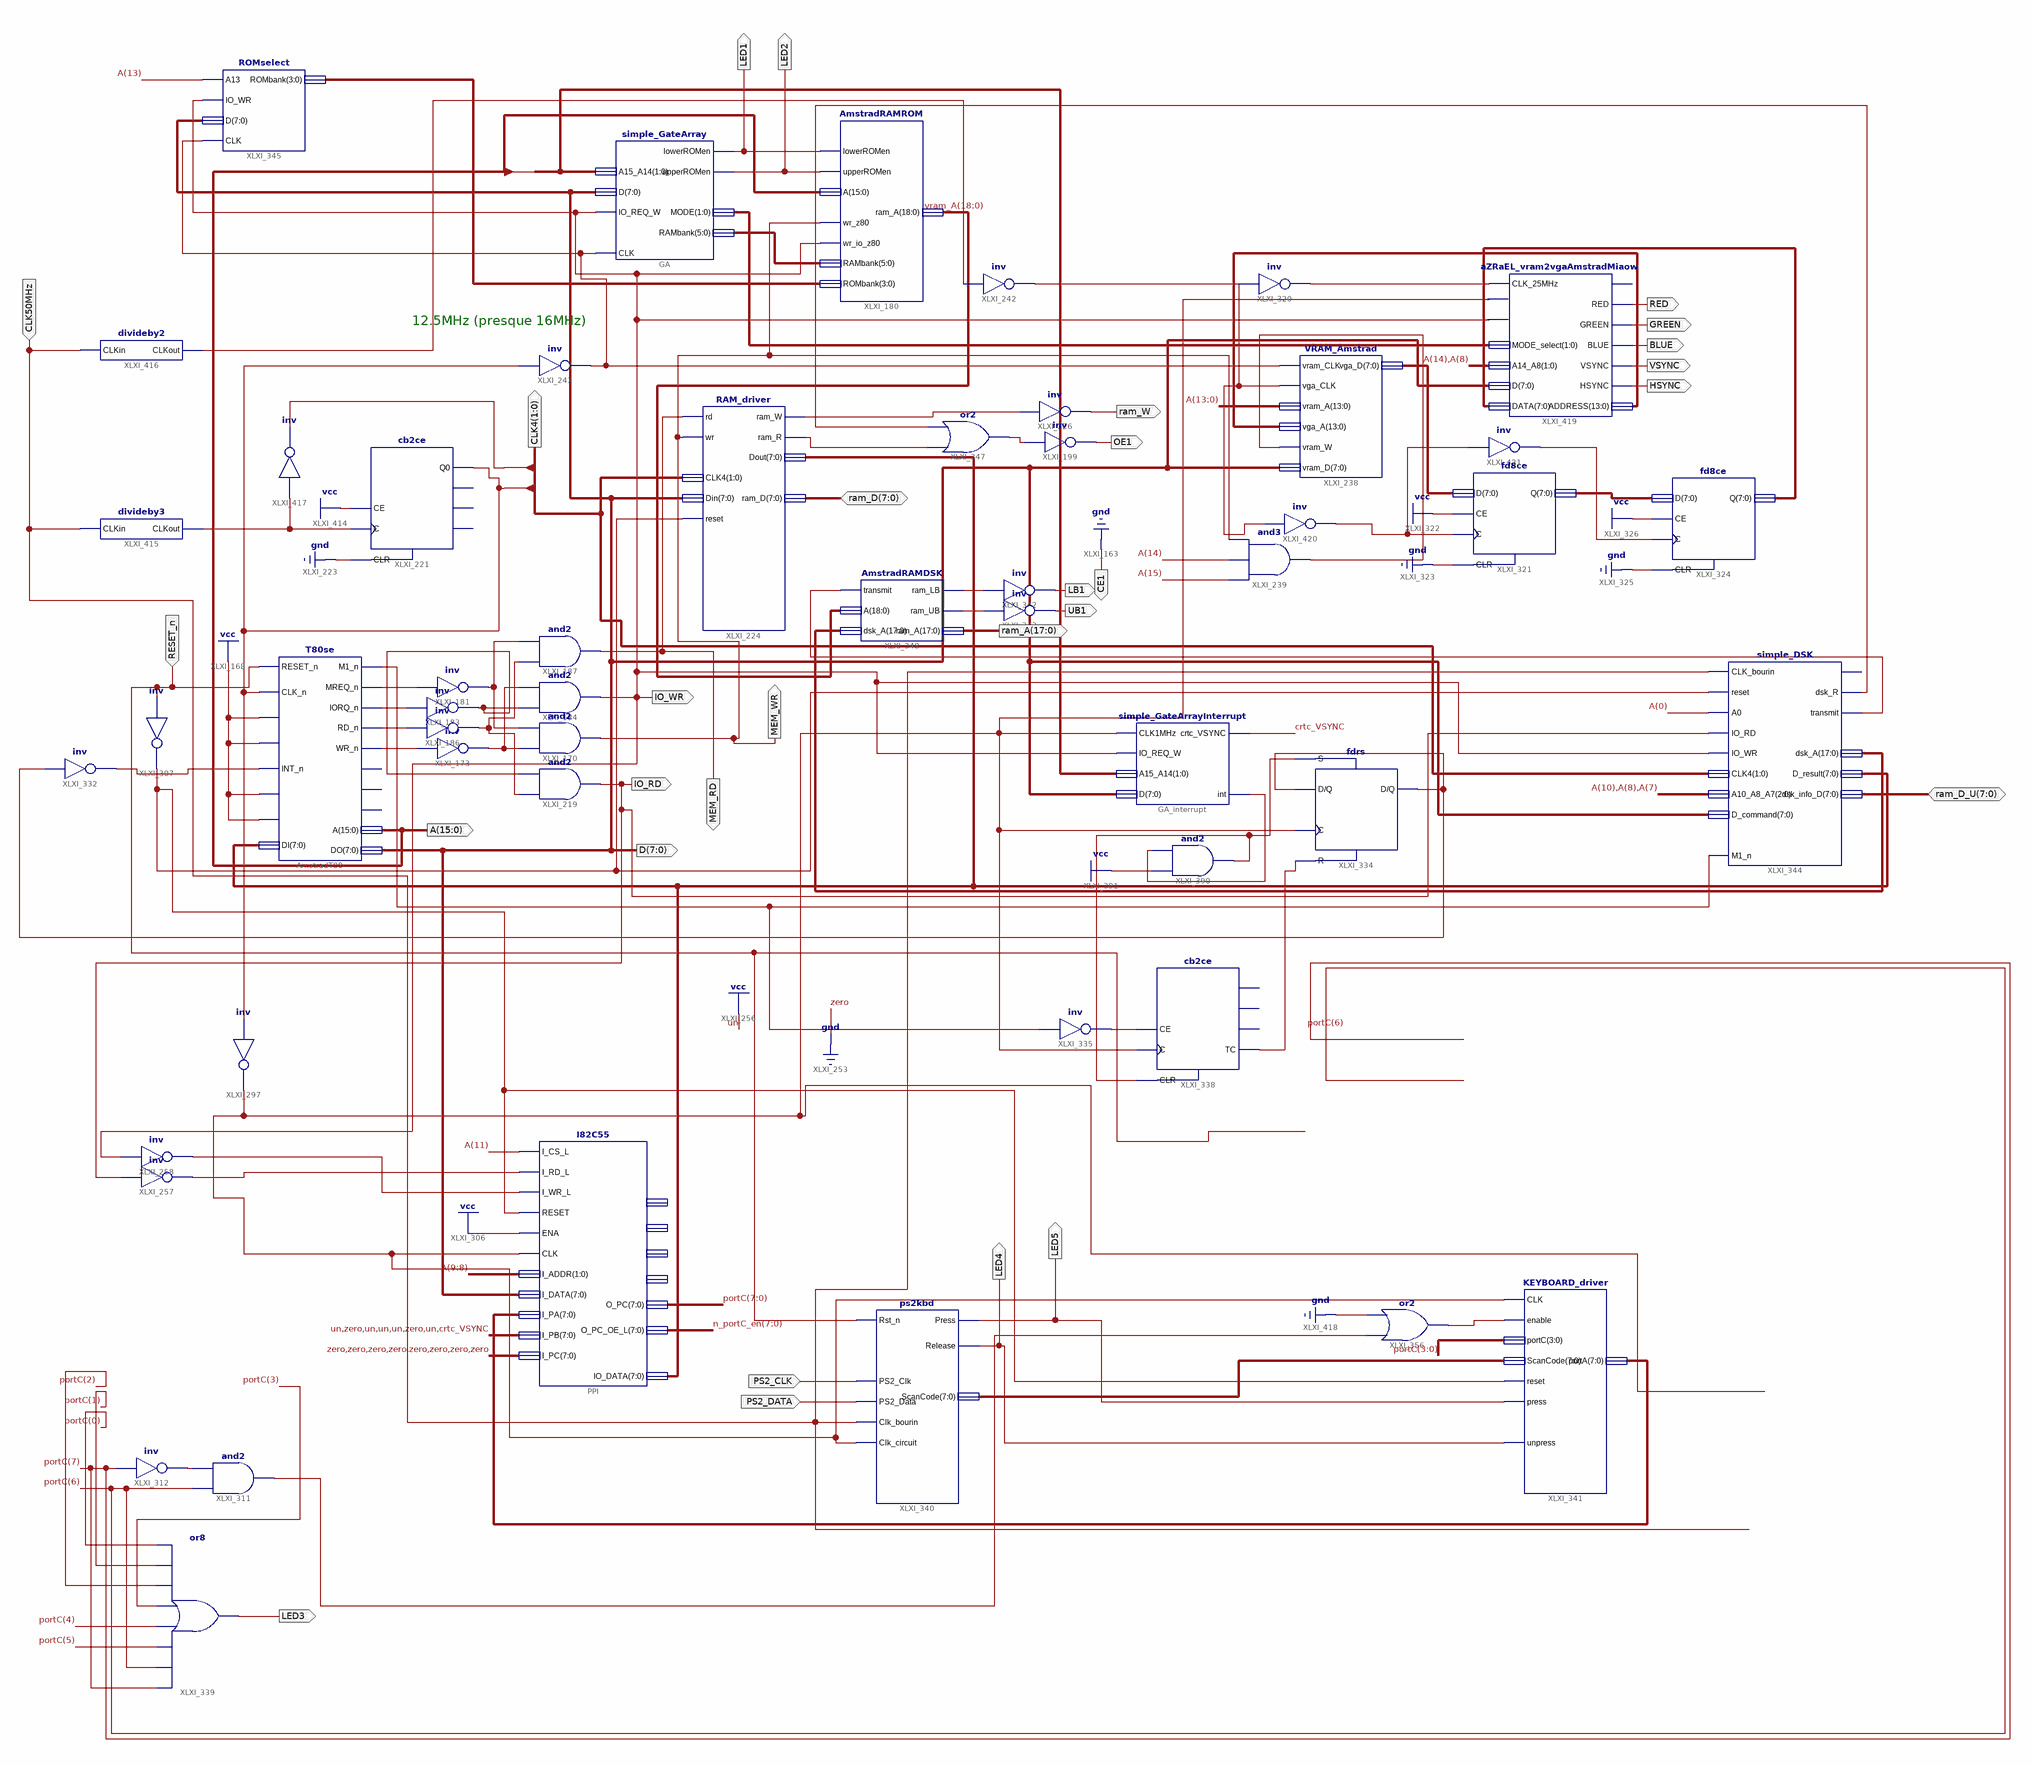
[diagram p0: schematic sheet 1]
// Xilinx ISE schematic amstrad_switch_z80_vga_sans_son.sch (spartan3e) as structural Verilog: 51 symbols, 29 ports
module amstrad_switch_z80_vga_sans_son (
  input  RESET_n,
  input  CLK50MHz,
  input  PS2_CLK,
  input  PS2_DATA,
  inout  [7:0] ram_D,
  inout  [7:0] ram_D_U,
  output LED1,
  output LED2,
  output [15:0] A,
  output IO_WR,
  output MEM_RD,
  output MEM_WR,
  output [7:0] D,
  output IO_RD,
  output [1:0] CLK4,
  output RED,
  output GREEN,
  output BLUE,
  output VSYNC,
  output HSYNC,
  output LED3,
  output LED5,
  output LED4,
  output CE1,
  output ram_W,
  output OE1,
  output UB1,
  output LB1,
  output [17:0] ram_A
);

  wire crtc_VSYNC, XLXN_37, XLXN_38, XLXN_58, XLXN_75, XLXN_76, XLXN_86, XLXN_88, XLXN_115, XLXN_137,
       XLXN_142, XLXN_153, XLXN_180, XLXN_301, XLXN_309, XLXN_327, XLXN_337, XLXN_358, XLXN_359, XLXN_360,
       XLXN_364, XLXN_370, XLXN_422, XLXN_423, XLXN_438, XLXN_441, XLXN_445, XLXN_446, XLXN_450, XLXN_451,
       XLXN_459, XLXN_477, XLXN_478, XLXN_497, XLXN_509, XLXN_544, XLXN_552, XLXN_553;
  wire [1:0] XLXN_548;
  wire [3:0] XLXN_435;
  wire [5:0] XLXN_434;
  wire [7:0] n_portC_en, portC, XLXN_283, XLXN_340, XLXN_408, XLXN_547, XLXN_549, XLXN_554;
  wire [13:0] XLXN_550;
  wire [17:0] XLXN_427;
  wire [18:0] vram_A;

  T80se AmstradT80 (
    .RESET_n(RESET_n), .CLK_n(CLK4[1]), .CLKEN(1'b1), .WAIT_n(1'b1), .INT_n(XLXN_438), .NMI_n(1'b1),
    .BUSRQ_n(1'b1), .DI(XLXN_283), .M1_n(XLXN_360), .MREQ_n(XLXN_58), .IORQ_n(XLXN_75), .RD_n(XLXN_86),
    .WR_n(XLXN_38), .A(A), .DO(D));  // open: RFSH_n, HALT_n, BUSAK_n
  and XLXI_170 (MEM_WR, XLXN_37, XLXN_115);
  not XLXI_173 (XLXN_37, XLXN_38);
  simple_GateArray GA (
    .CLK(XLXN_441), .IO_REQ_W(IO_WR), .A15_A14(A[15:14]), .D(D), .lowerROMen(LED1), .upperROMen(LED2),
    .RAMbank(XLXN_434), .MODE(XLXN_548));
  not XLXI_181 (XLXN_115, XLXN_58);
  not XLXI_183 (XLXN_76, XLXN_75);
  and XLXI_184 (IO_WR, XLXN_76, XLXN_37);
  not XLXI_186 (XLXN_88, XLXN_86);
  and XLXI_187 (MEM_RD, XLXN_88, XLXN_115);
  AmstradRAMROM XLXI_180 (
    .wr_z80(MEM_WR), .wr_io_z80(IO_WR), .lowerROMen(LED1), .upperROMen(LED2), .A(A), .RAMbank(XLXN_434),
    .ROMbank(XLXN_435), .ram_A(vram_A));
  and XLXI_219 (IO_RD, XLXN_88, XLXN_76);
  RAM_driver XLXI_224 (
    .rd(MEM_RD), .wr(MEM_WR), .reset(XLXN_309), .CLK4(CLK4), .Din(D), .Dout(XLXN_283), .ram_D(ram_D),
    .ram_W(XLXN_446), .ram_R(XLXN_450));
  VRAM_Amstrad XLXI_238 (
    .vram_CLK(XLXN_441), .vga_CLK(XLXN_153), .vram_A(A[13:0]), .vga_A(XLXN_550), .vram_W(XLXN_137),
    .vram_D(D), .vga_D(XLXN_340));
  and XLXI_239 (XLXN_137, A[15], A[14], MEM_WR);
  not XLXI_242 (XLXN_153, XLXN_142);
  not XLXI_243 (XLXN_441, CLK4[1]);
  not XLXI_257 (XLXN_301, IO_RD);
  not XLXI_258 (XLXN_180, IO_WR);
  not XLXI_297 (XLXN_497, CLK4[1]);
  I82C55 PPI (
    .I_CS_L(A[11]), .I_RD_L(XLXN_301), .I_WR_L(XLXN_180), .RESET(XLXN_309), .ENA(1'b1), .CLK(XLXN_497),
    .I_ADDR(A[9:8]), .I_DATA(D), .I_PA(XLXN_547), .I_PB({7'b1011101, crtc_VSYNC}), .I_PC({8{1'b0}}),
    .IO_DATA(XLXN_283), .O_PC(portC), .O_PC_OE_L(n_portC_en));  // open: O_PA, O_PA_OE_L, O_PB, O_PB_OE_L
  not XLXI_307 (XLXN_309, RESET_n);
  and XLXI_311 (XLXN_477, portC[6], XLXN_327);
  not XLXI_312 (XLXN_327, portC[7]);
  not XLXI_320 (XLXN_337, XLXN_153);
  fd8ce XLXI_321 (.C(XLXN_553), .CE(1'b1), .CLR(1'b0), .D(XLXN_340), .Q(XLXN_554));
  fd8ce XLXI_324 (.C(XLXN_552), .CE(1'b1), .CLR(1'b0), .D(XLXN_554), .Q(XLXN_549));
  simple_GateArrayInterrupt GA_interrupt (
    .CLK1MHz(XLXN_497), .IO_REQ_W(IO_WR), .A15_A14(A[15:14]), .D(D), .crtc_VSYNC(crtc_VSYNC), .\int (XLXN_509));
  not XLXI_332 (XLXN_438, XLXN_359);
  fdrs XLXI_334 (.C(XLXN_497), .D(XLXN_359), .R(XLXN_364), .S(XLXN_358), .Q(XLXN_359));
  not XLXI_335 (XLXN_370, XLXN_360);
  cb2ce XLXI_338 (.C(XLXN_497), .CE(XLXN_370), .CLR(XLXN_358), .TC(XLXN_364));  // open: CEO, Q0, Q1
  or XLXI_339 (LED3, portC[7], portC[6], portC[5], portC[4], portC[3], portC[2], portC[1], portC[0]);
  ps2kbd XLXI_340 (
    .Rst_n(RESET_n), .Clk_bourin(CLK50MHz), .Clk_circuit(XLXN_497), .PS2_Clk(PS2_CLK), .PS2_Data(PS2_DATA),
    .Press(LED5), .Release(LED4), .ScanCode(XLXN_408));
  KEYBOARD_driver XLXI_341 (
    .CLK(XLXN_497), .reset(XLXN_309), .enable(XLXN_478), .press(LED5), .unpress(LED4), .portC(portC[3:0]),
    .ScanCode(XLXN_408), .portA(XLXN_547));
  simple_DSK XLXI_344 (
    .CLK_bourin(CLK50MHz), .reset(XLXN_309), .A0(A[0]), .IO_RD(IO_RD), .IO_WR(IO_WR), .M1_n(XLXN_360),
    .CLK4(CLK4), .A10_A8_A7({A[10], A[8:7]}), .D_command(D), .D_result(XLXN_283), .dsk_info_D(ram_D_U),
    .dsk_R(XLXN_445), .transmit(XLXN_459), .dsk_A(XLXN_427));  // open: dsk_W
  ROMselect XLXI_345 (.A13(A[13]), .IO_WR(IO_WR), .D(D), .ROMbank(XLXN_435), .CLK(XLXN_441));
  not XLXI_226 (ram_W, XLXN_446);
  or XLXI_347 (XLXN_451, XLXN_450, XLXN_445);
  not XLXI_199 (OE1, XLXN_451);
  AmstradRAMDSK XLXI_348 (
    .transmit(XLXN_459), .A(vram_A), .dsk_A(XLXN_427), .ram_LB(XLXN_422), .ram_UB(XLXN_423), .ram_A(ram_A));
  not XLXI_342 (LB1, XLXN_422);
  not XLXI_343 (UB1, XLXN_423);
  or XLXI_356 (XLXN_478, XLXN_477, 1'b0);
  and XLXI_390 (XLXN_358, 1'b1, XLXN_509);
  cb2ce XLXI_221 (.C(XLXN_544), .CE(1'b1), .CLR(1'b0), .Q0(CLK4[1]));  // open: CEO, Q1, TC
  divideby3 XLXI_415 (.CLKin(CLK50MHz), .CLKout(XLXN_544));
  divideby2 XLXI_416 (.CLKin(CLK50MHz), .CLKout(XLXN_142));
  not XLXI_417 (CLK4[0], XLXN_544);
  aZRaEL_vram2vgaAmstradMiaow XLXI_419 (
    .CLK_25MHz(XLXN_337), .CLK_4MHz(XLXN_497), .IO_WR(IO_WR), .DATA(XLXN_549), .A14_A8({A[14], A[8]}), .D(D),
    .MODE_select(XLXN_548), .RED(RED), .GREEN(GREEN), .BLUE(BLUE), .VSYNC(VSYNC), .HSYNC(HSYNC),
    .ADDRESS(XLXN_550));  // open: R
  not XLXI_420 (XLXN_553, XLXN_153);
  not XLXI_421 (XLXN_552, XLXN_553);

  assign CE1 = 1'b0;

  // Notes on the sheet:
  //   12.5MHz (presque 16MHz)
endmodule
